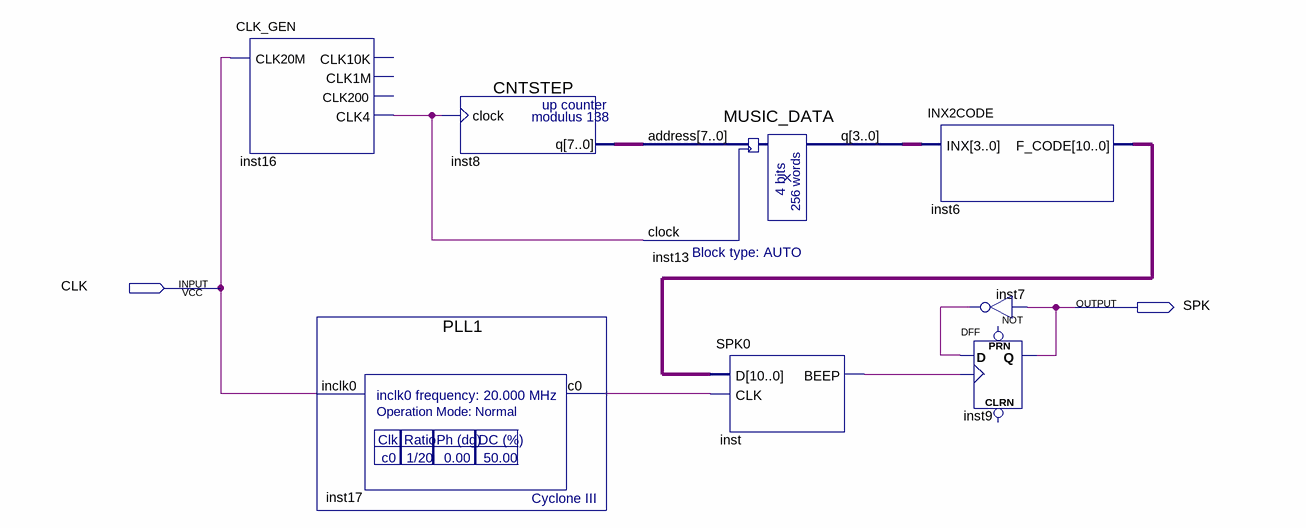
[diagram p0: schematic sheet]
// Quartus schematic zidongmusic.bdf as structural Verilog: 8 symbols, 2 pins
module zidongmusic (
  input  CLK,
  output SPK
);

  wire inst7_out, inst16_clk4, inst17_c0, inst_beep;
  wire [3:0] inst13_q;
  wire [7:0] inst8_q;
  wire [10:0] inst6_f_code;

  CLK_GEN inst16 (.CLK20M(CLK), .CLK4(inst16_clk4));  // open: CLK10K, CLK1M, CLK200
  PLL1 inst17 (.inclk0(CLK), .c0(inst17_c0));
  CNTSTEP inst8 (.clock(inst16_clk4), .q(inst8_q));
  MUSIC_DATA inst13 (.address(inst8_q), .clock(inst16_clk4), .q(inst13_q));
  SPK0 inst (.D(inst6_f_code), .CLK(inst17_c0), .BEEP(inst_beep));
  INX2CODE inst6 (.INX(inst13_q), .F_CODE(inst6_f_code));
  not inst7 (inst7_out, SPK);
  DFF inst9 (.CLK(inst_beep), .D(inst7_out), .Q(SPK));  // open: CLRN, PRN
endmodule
